# EAGLE schematic RGBLineSensor (EAGLE 9.6.2)
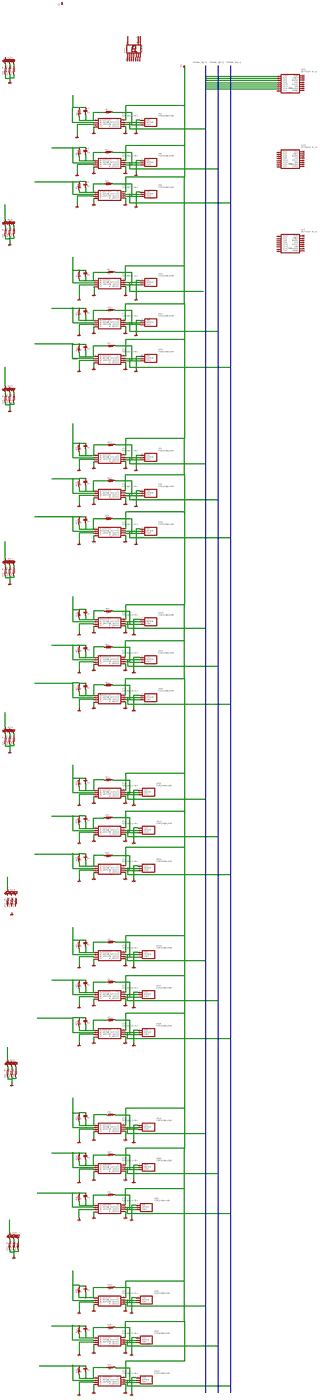
[diagram p0: schematic, sheet 1, overview]
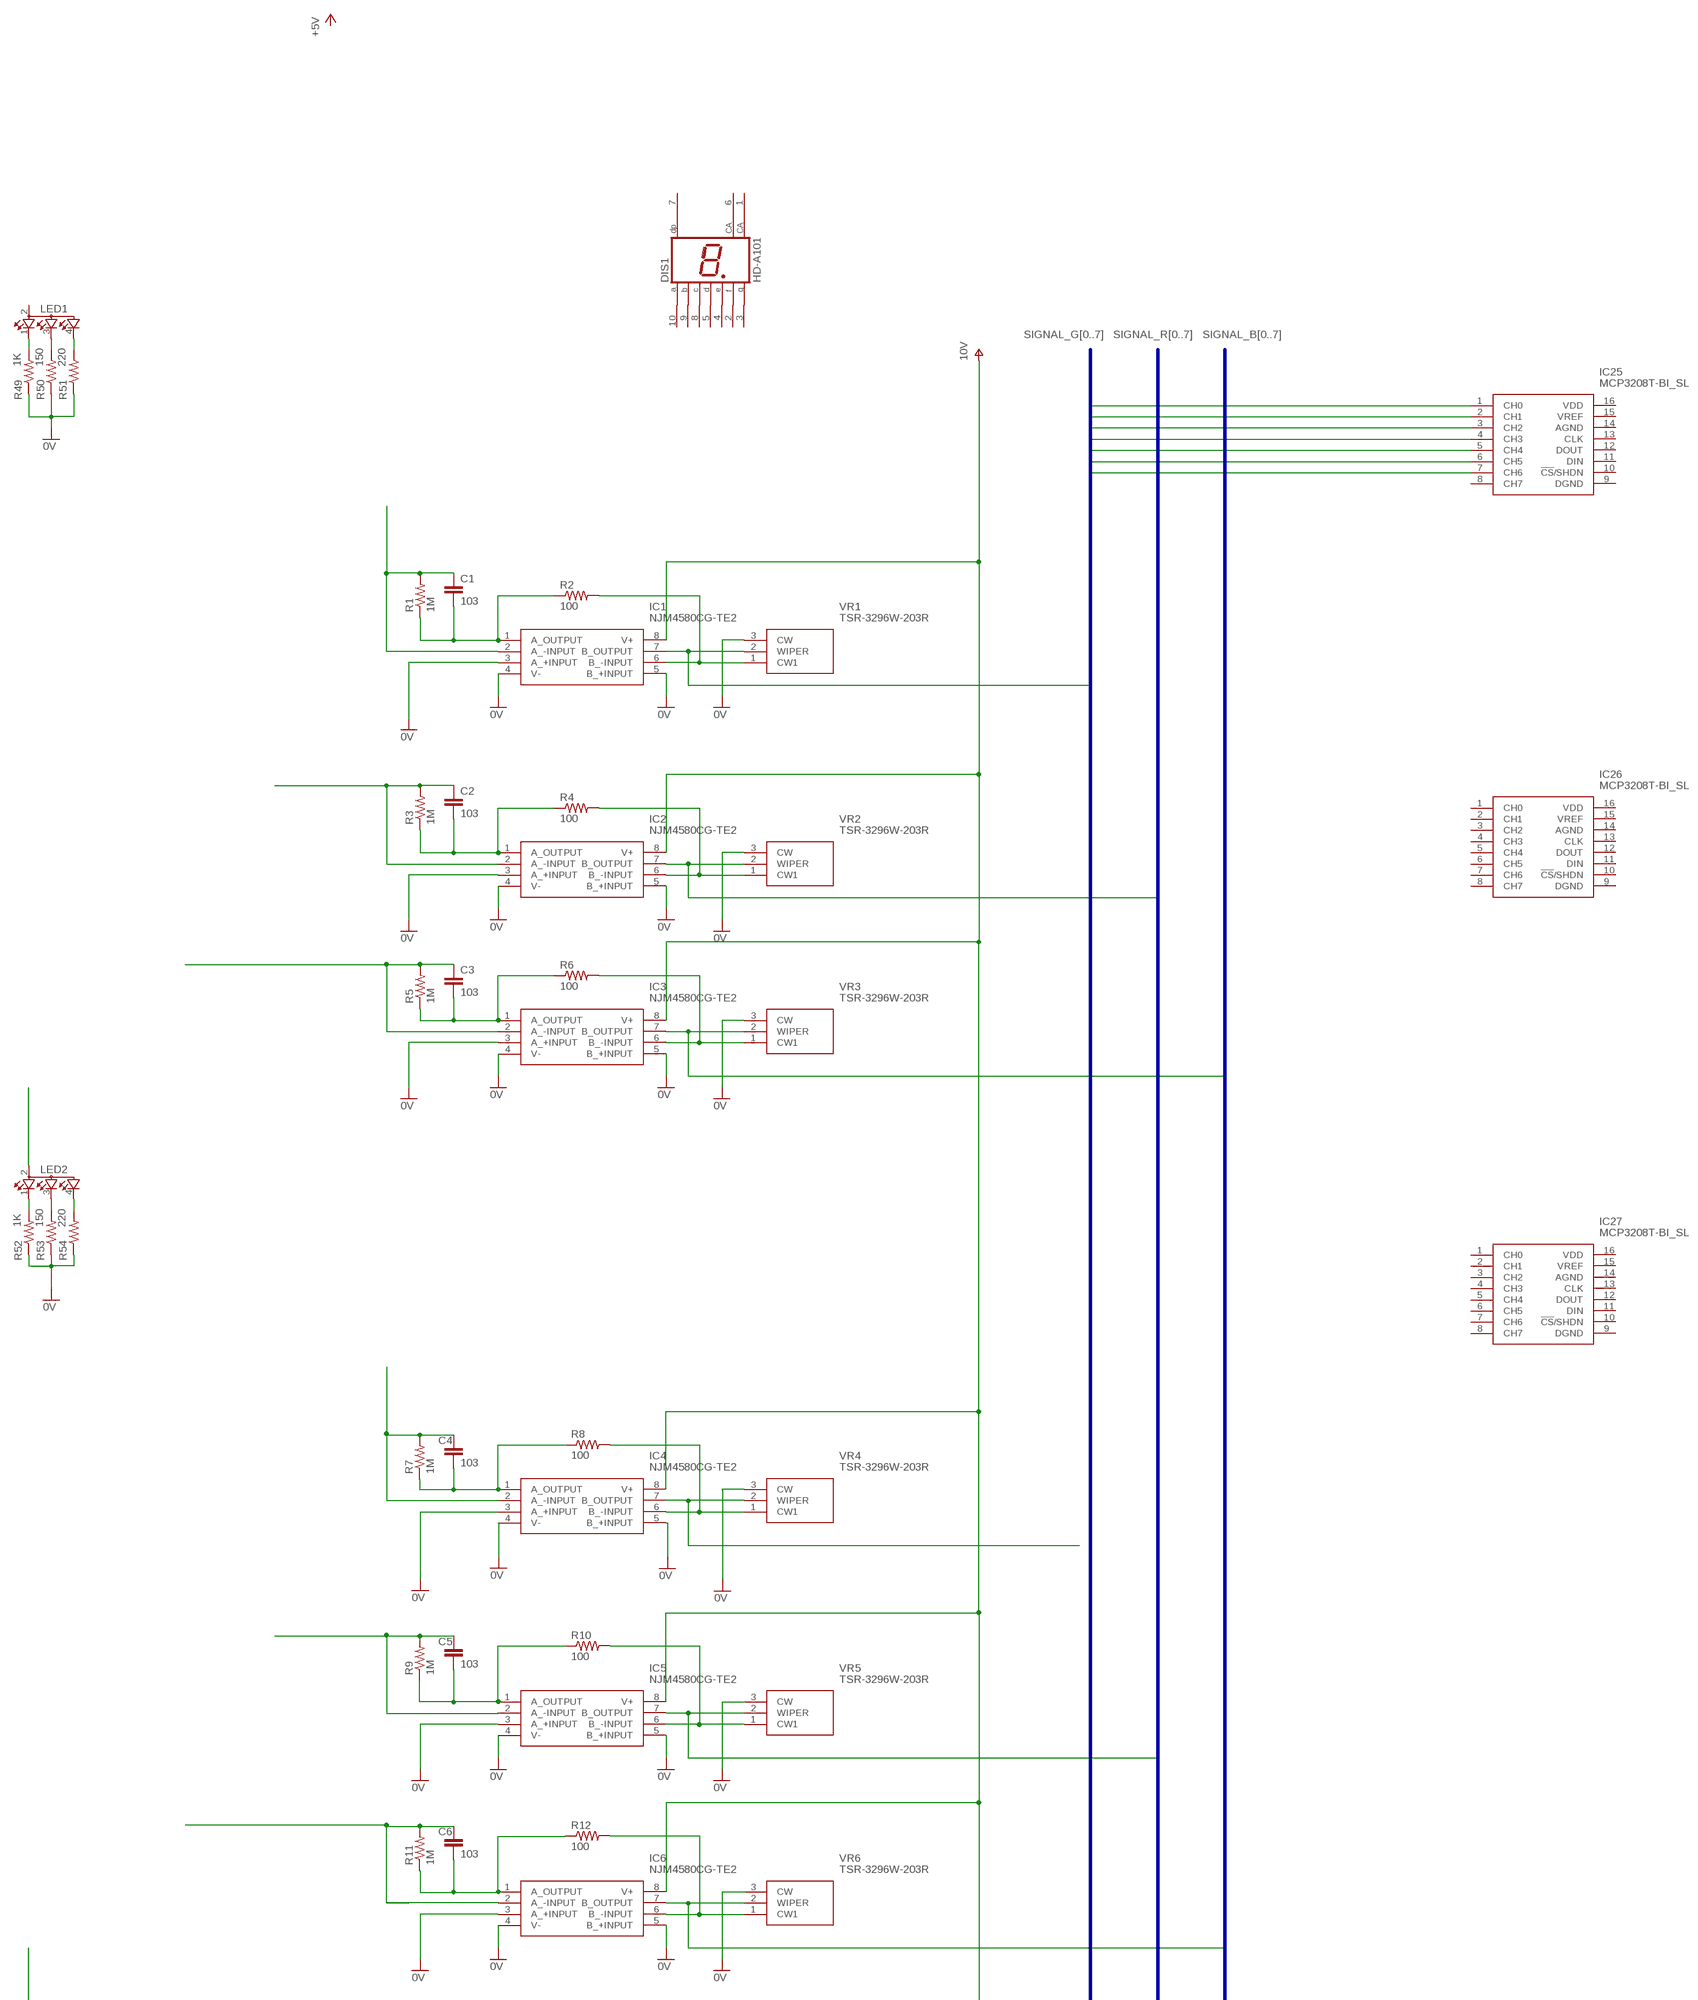
[diagram p1: schematic, sheet 1, part 1 of 4]
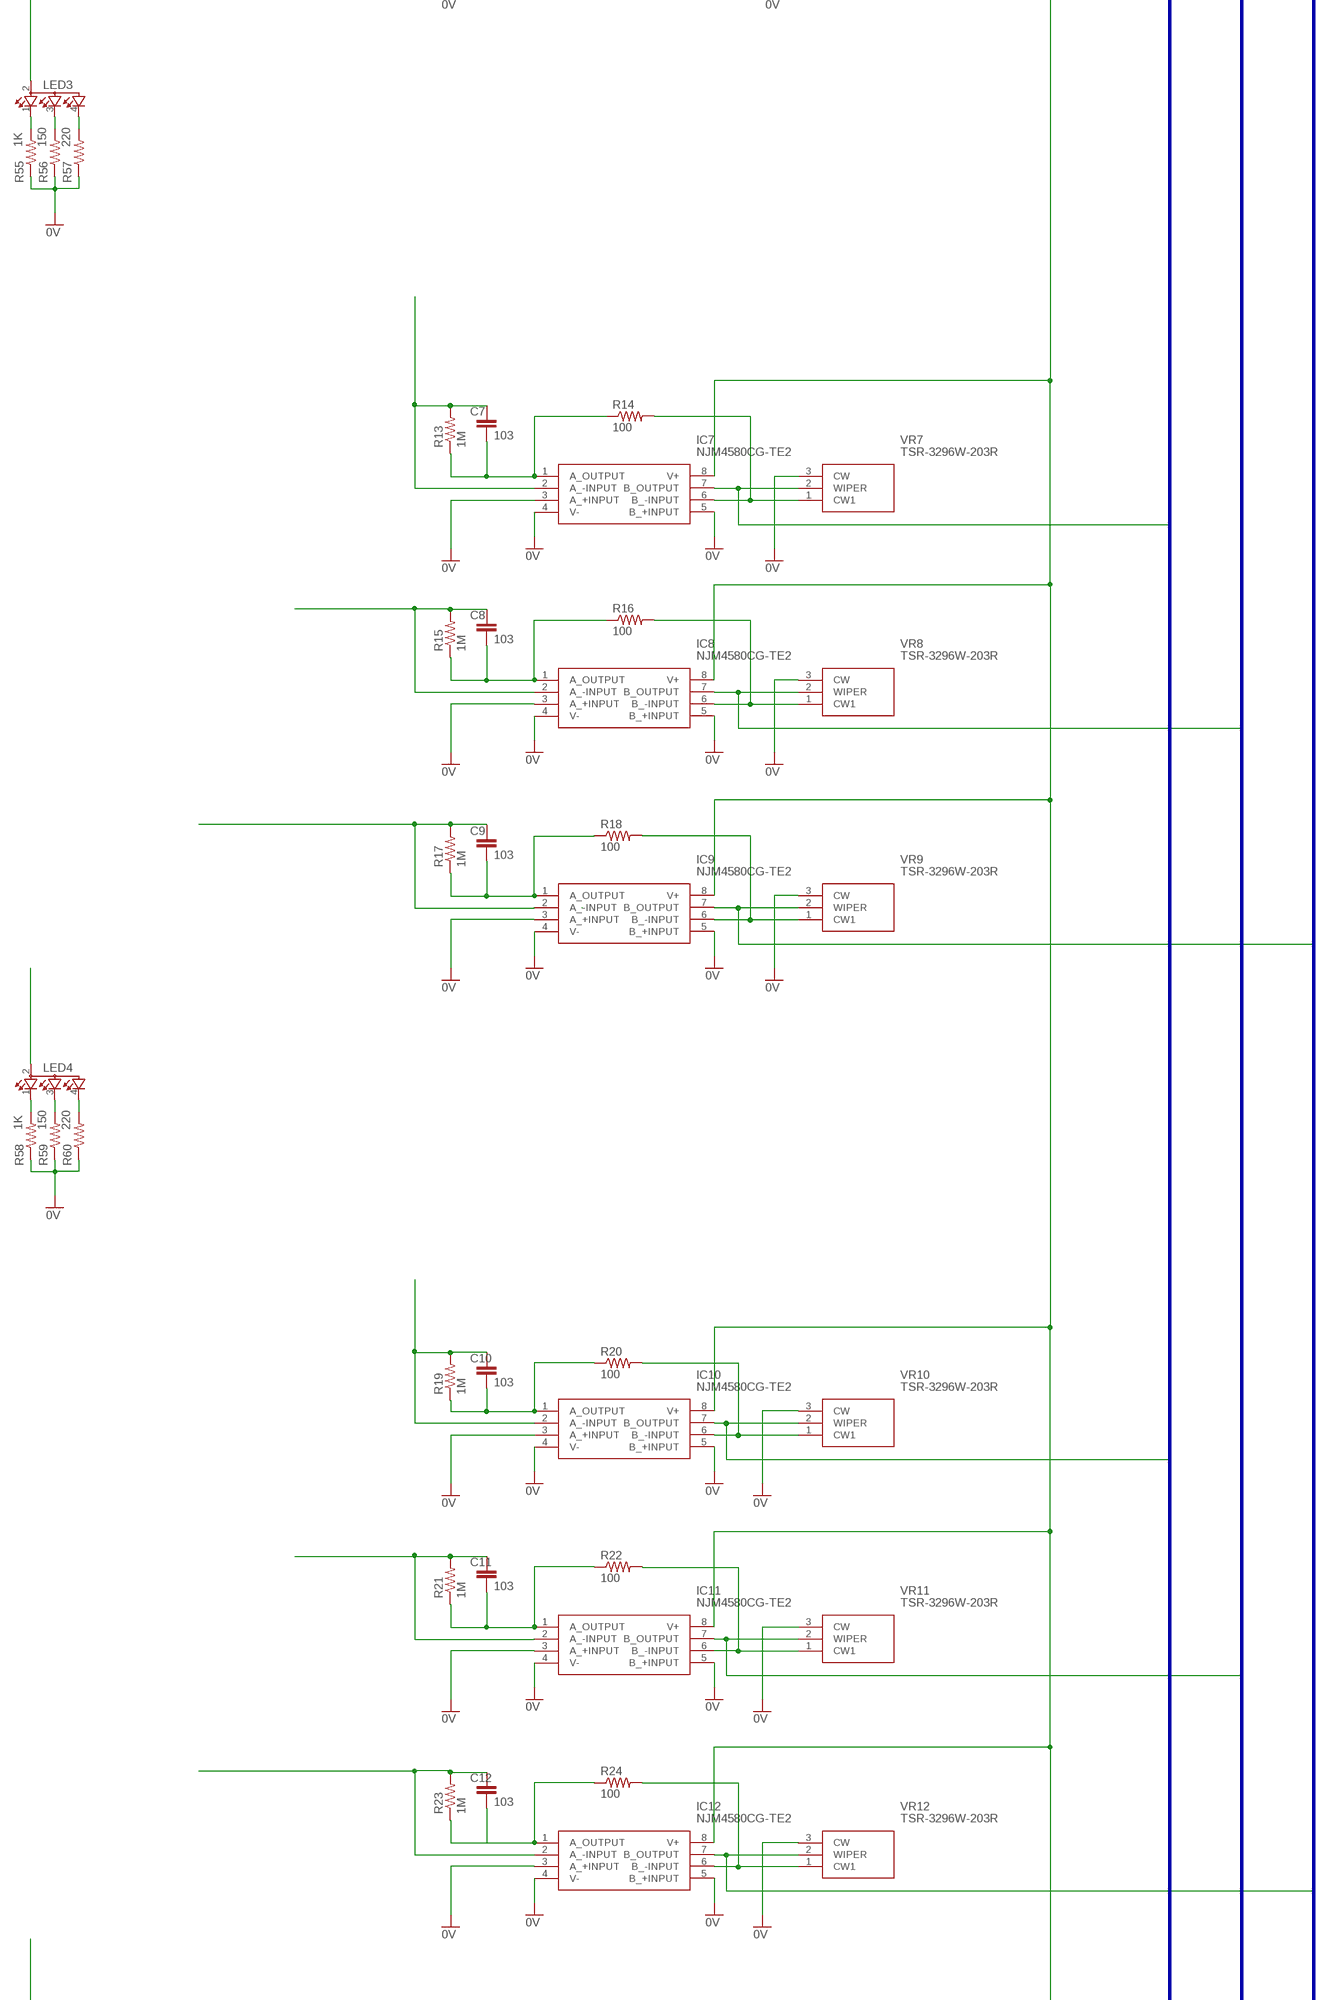
[diagram p2: schematic, sheet 1, part 2 of 4]
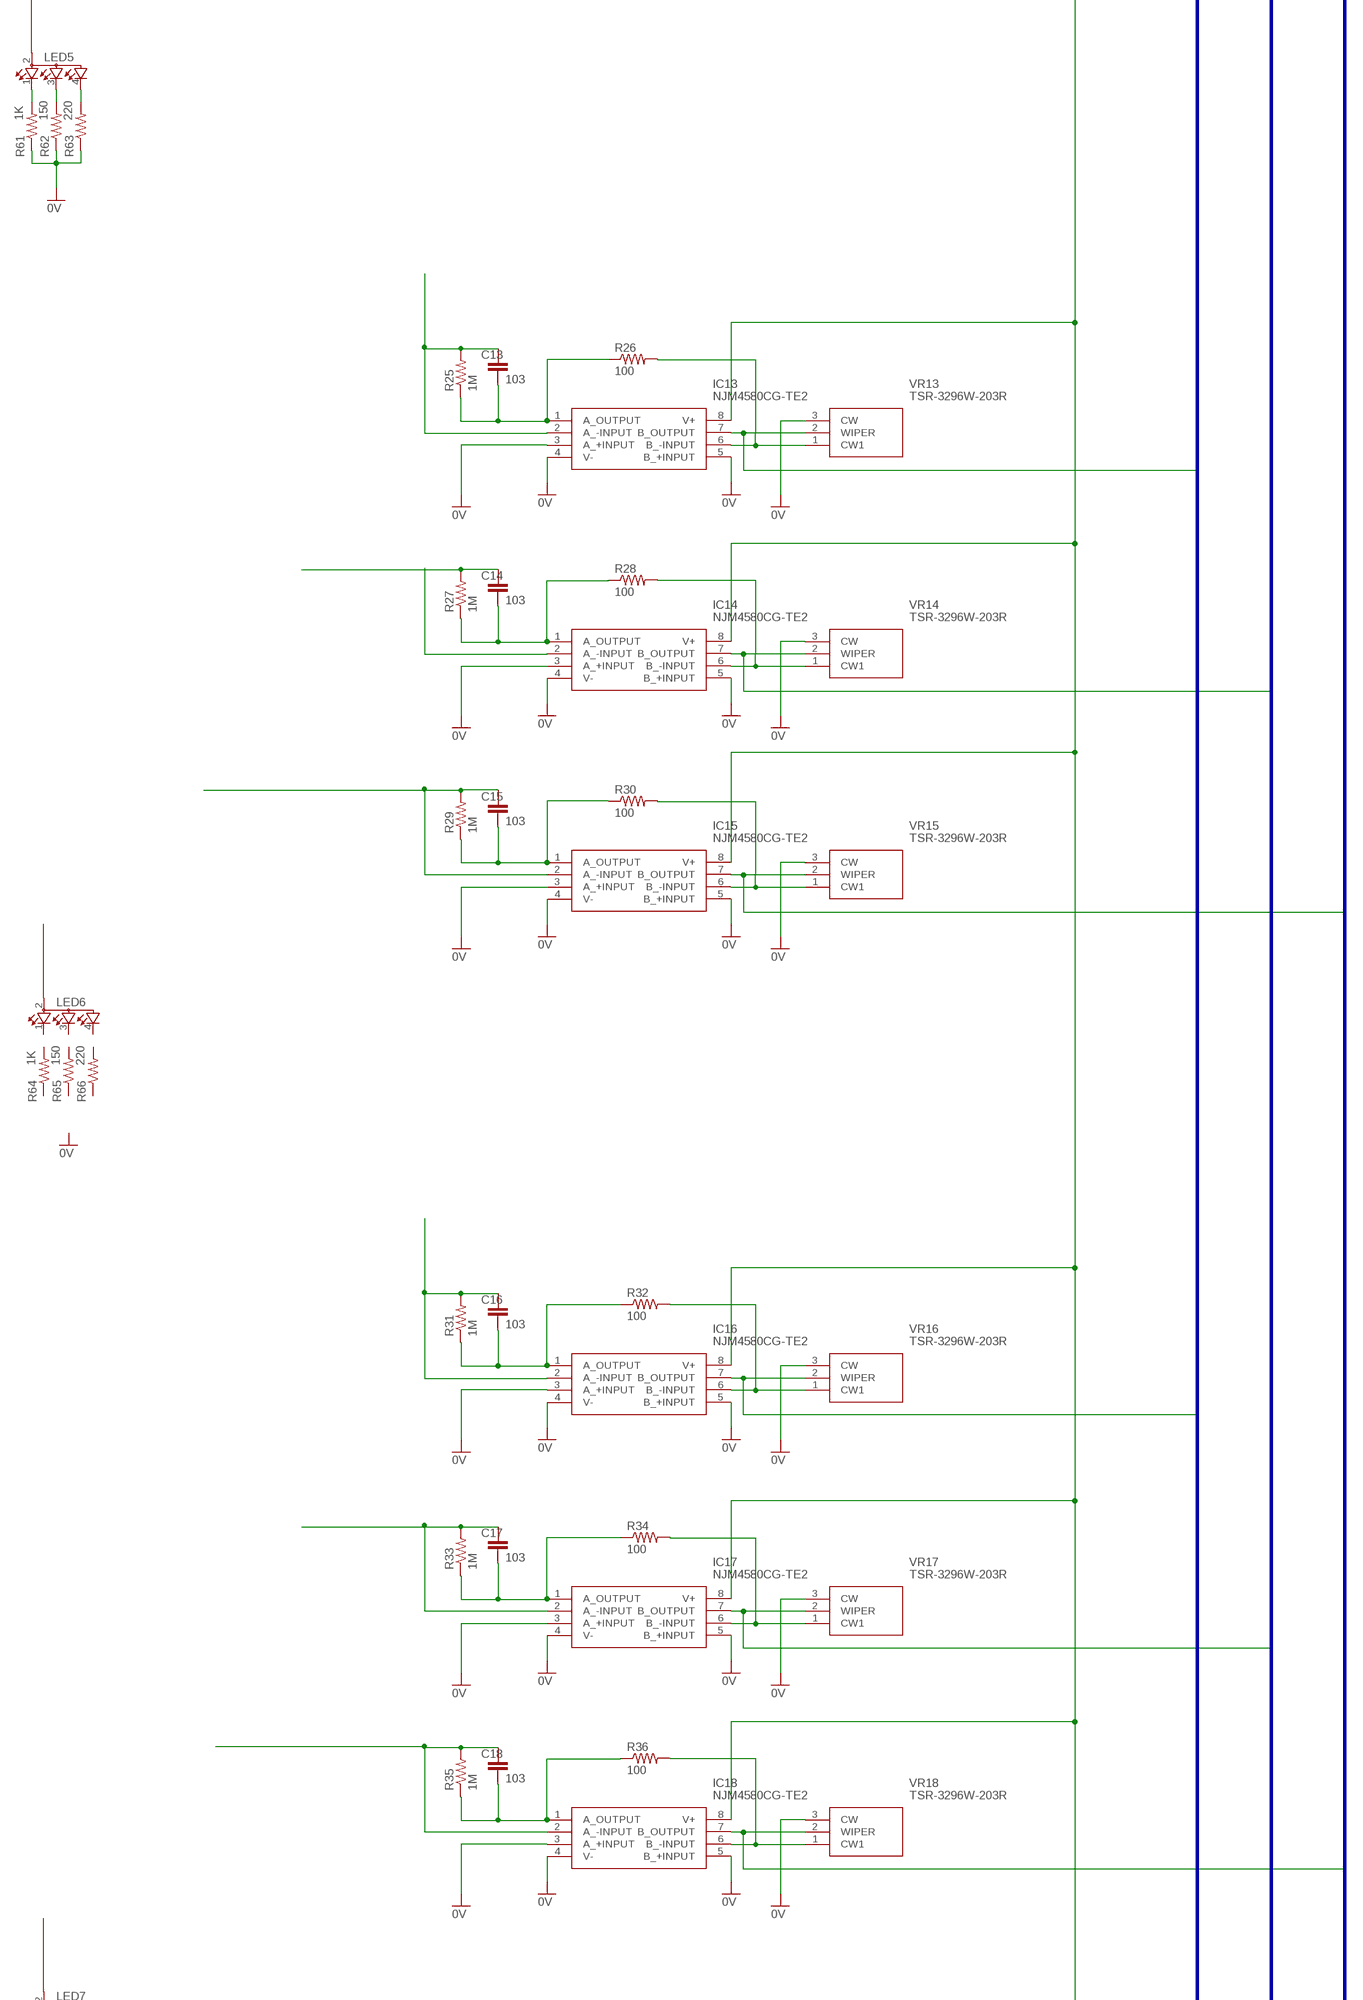
[diagram p3: schematic, sheet 1, part 3 of 4]
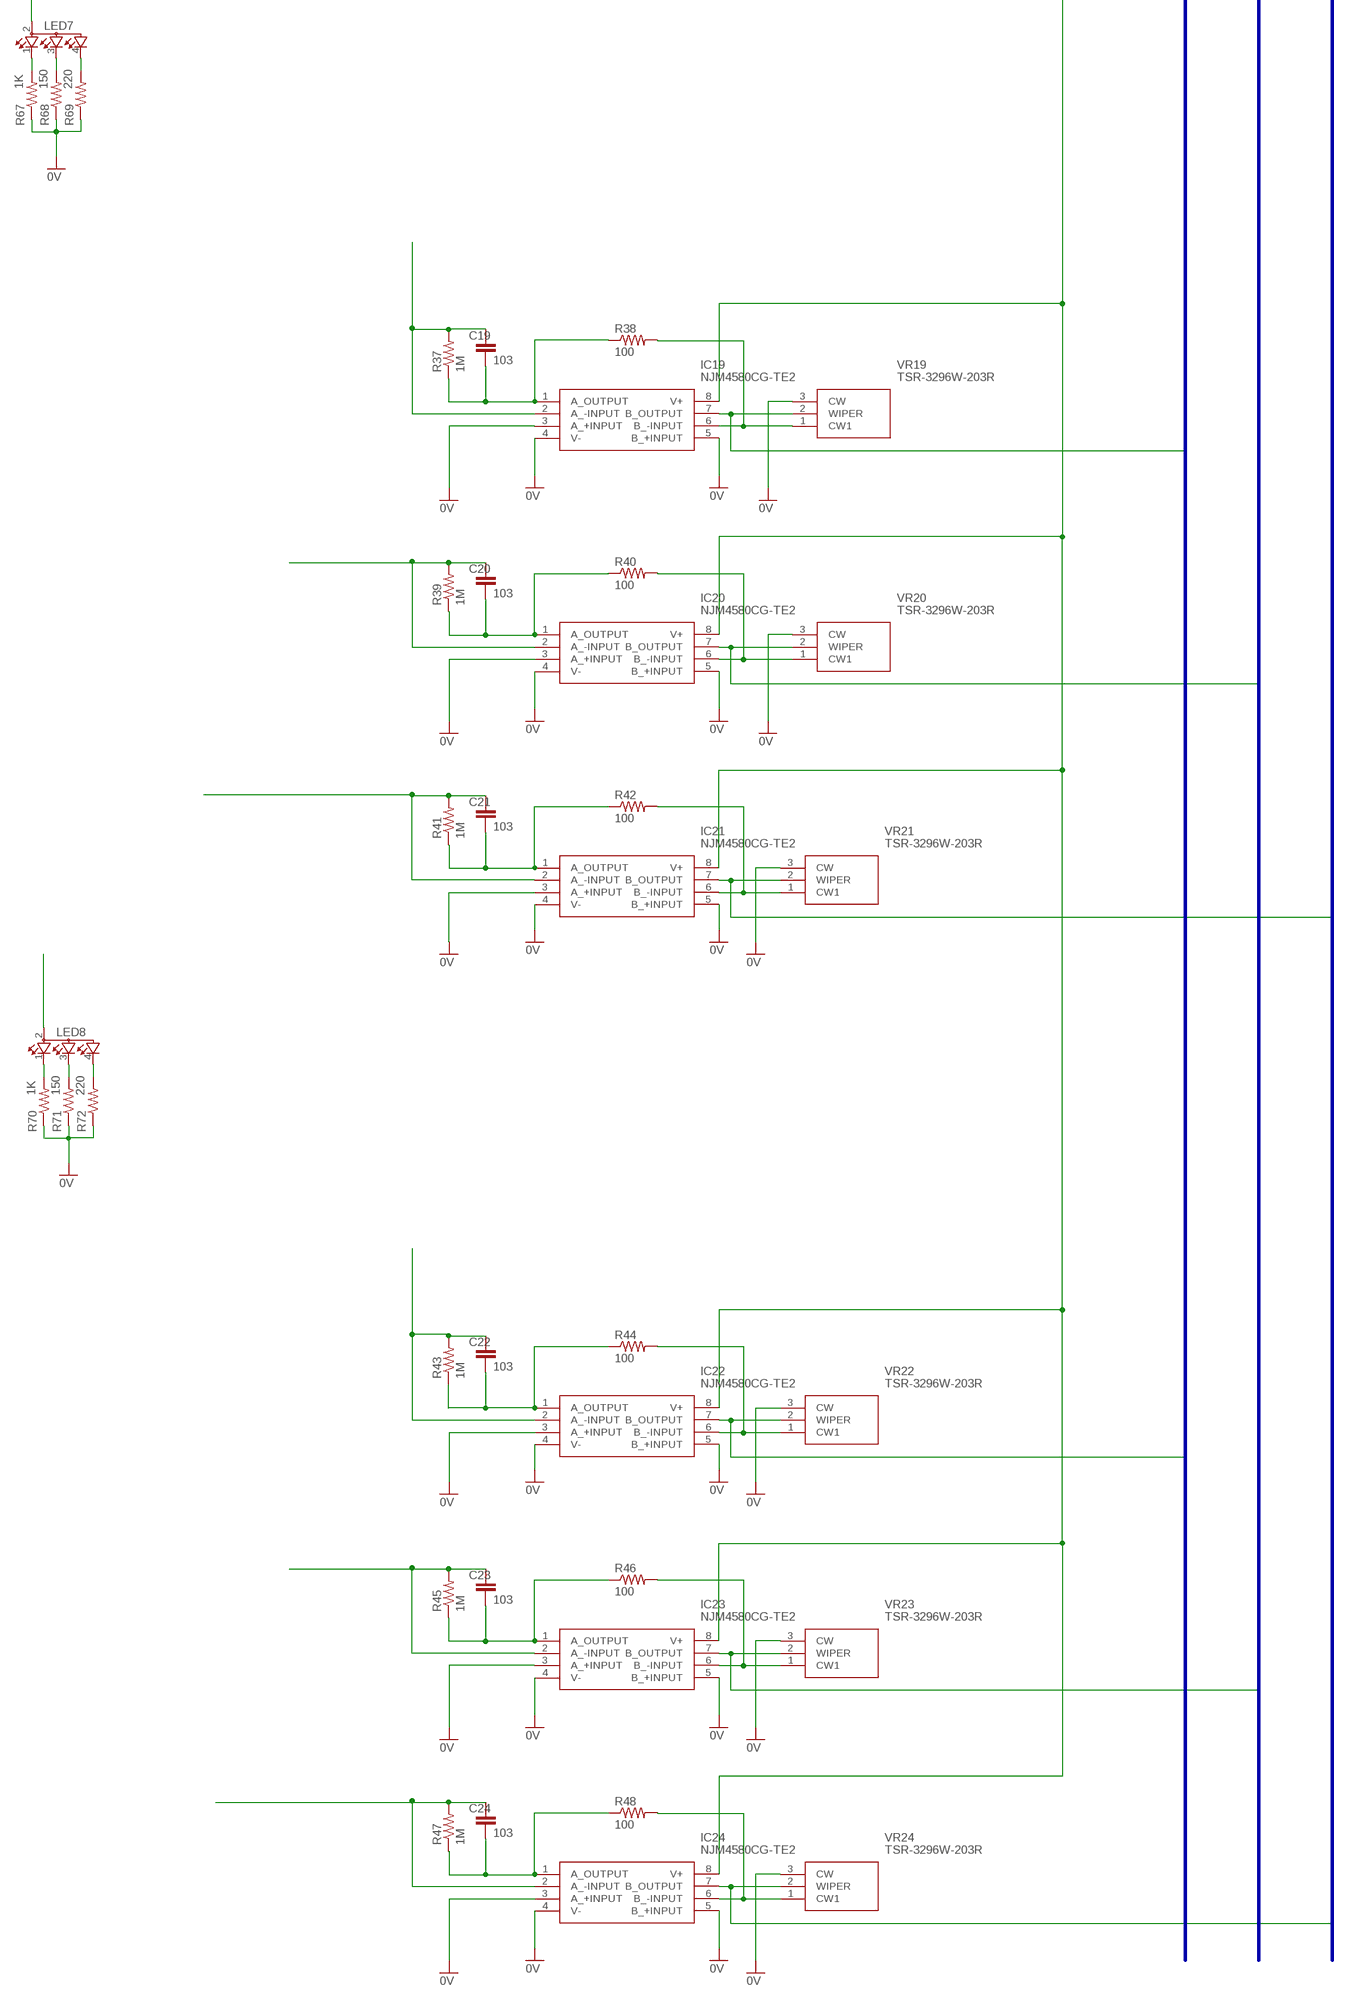
[diagram p4: schematic, sheet 1, part 4 of 4]

## Parts
C1  103  C-EUC2012  [C2012]
C2  103  C-EUC2012  [C2012]
C3  103  C-EUC2012  [C2012]
C4  103  C-EUC2012  [C2012]
C5  103  C-EUC2012  [C2012]
C6  103  C-EUC2012  [C2012]
C7  103  C-EUC2012  [C2012]
C8  103  C-EUC2012  [C2012]
C9  103  C-EUC2012  [C2012]
C10  103  C-EUC2012  [C2012]
C11  103  C-EUC2012  [C2012]
C12  103  C-EUC2012  [C2012]
C13  103  C-EUC2012  [C2012]
C14  103  C-EUC2012  [C2012]
C15  103  C-EUC2012  [C2012]
C16  103  C-EUC2012  [C2012]
C17  103  C-EUC2012  [C2012]
C18  103  C-EUC2012  [C2012]
C19  103  C-EUC2012  [C2012]
C20  103  C-EUC2012  [C2012]
C21  103  C-EUC2012  [C2012]
C22  103  C-EUC2012  [C2012]
C23  103  C-EUC2012  [C2012]
C24  103  C-EUC2012  [C2012]
DIS1  HD-A101  [HDSP-A]
IC1  NJM4580CG-TE2  [SOIC127P600X175-8N]
IC2  NJM4580CG-TE2  [SOIC127P600X175-8N]
IC3  NJM4580CG-TE2  [SOIC127P600X175-8N]
IC4  NJM4580CG-TE2  [SOIC127P600X175-8N]
IC5  NJM4580CG-TE2  [SOIC127P600X175-8N]
IC6  NJM4580CG-TE2  [SOIC127P600X175-8N]
IC7  NJM4580CG-TE2  [SOIC127P600X175-8N]
IC8  NJM4580CG-TE2  [SOIC127P600X175-8N]
IC9  NJM4580CG-TE2  [SOIC127P600X175-8N]
IC10  NJM4580CG-TE2  [SOIC127P600X175-8N]
IC11  NJM4580CG-TE2  [SOIC127P600X175-8N]
IC12  NJM4580CG-TE2  [SOIC127P600X175-8N]
IC13  NJM4580CG-TE2  [SOIC127P600X175-8N]
IC14  NJM4580CG-TE2  [SOIC127P600X175-8N]
IC15  NJM4580CG-TE2  [SOIC127P600X175-8N]
IC16  NJM4580CG-TE2  [SOIC127P600X175-8N]
IC17  NJM4580CG-TE2  [SOIC127P600X175-8N]
IC18  NJM4580CG-TE2  [SOIC127P600X175-8N]
IC19  NJM4580CG-TE2  [SOIC127P600X175-8N]
IC20  NJM4580CG-TE2  [SOIC127P600X175-8N]
IC21  NJM4580CG-TE2  [SOIC127P600X175-8N]
IC22  NJM4580CG-TE2  [SOIC127P600X175-8N]
IC23  NJM4580CG-TE2  [SOIC127P600X175-8N]
IC24  NJM4580CG-TE2  [SOIC127P600X175-8N]
IC25  MCP3208T-BI_SL  [SOIC127P600X175-16N]
IC26  MCP3208T-BI_SL  [SOIC127P600X175-16N]
IC27  MCP3208T-BI_SL  [SOIC127P600X175-16N]
LED1  TOPLED-3  [P-LCC-4-3]
LED2  TOPLED-3  [P-LCC-4-3]
LED3  TOPLED-3  [P-LCC-4-3]
LED4  TOPLED-3  [P-LCC-4-3]
LED5  TOPLED-3  [P-LCC-4-3]
LED6  TOPLED-3  [P-LCC-4-3]
LED7  TOPLED-3  [P-LCC-4-3]
LED8  TOPLED-3  [P-LCC-4-3]
R1  1M  R-US_R0402  [R0402]
R2  100  R-US_R0402  [R0402]
R3  1M  R-US_R0402  [R0402]
R4  100  R-US_R0402  [R0402]
R5  1M  R-US_R0402  [R0402]
R6  100  R-US_R0402  [R0402]
R7  1M  R-US_R0402  [R0402]
R8  100  R-US_R0402  [R0402]
R9  1M  R-US_R0402  [R0402]
R10  100  R-US_R0402  [R0402]
R11  1M  R-US_R0402  [R0402]
R12  100  R-US_R0402  [R0402]
R13  1M  R-US_R0402  [R0402]
R14  100  R-US_R0402  [R0402]
R15  1M  R-US_R0402  [R0402]
R16  100  R-US_R0402  [R0402]
R17  1M  R-US_R0402  [R0402]
R18  100  R-US_R0402  [R0402]
R19  1M  R-US_R0402  [R0402]
R20  100  R-US_R0402  [R0402]
R21  1M  R-US_R0402  [R0402]
R22  100  R-US_R0402  [R0402]
R23  1M  R-US_R0402  [R0402]
R24  100  R-US_R0402  [R0402]
R25  1M  R-US_R0402  [R0402]
R26  100  R-US_R0402  [R0402]
R27  1M  R-US_R0402  [R0402]
R28  100  R-US_R0402  [R0402]
R29  1M  R-US_R0402  [R0402]
R30  100  R-US_R0402  [R0402]
R31  1M  R-US_R0402  [R0402]
R32  100  R-US_R0402  [R0402]
R33  1M  R-US_R0402  [R0402]
R34  100  R-US_R0402  [R0402]
R35  1M  R-US_R0402  [R0402]
R36  100  R-US_R0402  [R0402]
R37  1M  R-US_R0402  [R0402]
R38  100  R-US_R0402  [R0402]
R39  1M  R-US_R0402  [R0402]
R40  100  R-US_R0402  [R0402]
R41  1M  R-US_R0402  [R0402]
R42  100  R-US_R0402  [R0402]
R43  1M  R-US_R0402  [R0402]
R44  100  R-US_R0402  [R0402]
R45  1M  R-US_R0402  [R0402]
R46  100  R-US_R0402  [R0402]
R47  1M  R-US_R0402  [R0402]
R48  100  R-US_R0402  [R0402]
R49  1K  R-US_R0402  [R0402]
R50  150  R-US_R0402  [R0402]
R51  220  R-US_R0402  [R0402]
R52  1K  R-US_R0402  [R0402]
R53  150  R-US_R0402  [R0402]
R54  220  R-US_R0402  [R0402]
R55  1K  R-US_R0402  [R0402]
R56  150  R-US_R0402  [R0402]
R57  220  R-US_R0402  [R0402]
R58  1K  R-US_R0402  [R0402]
R59  150  R-US_R0402  [R0402]
R60  220  R-US_R0402  [R0402]
R61  1K  R-US_R0402  [R0402]
R62  150  R-US_R0402  [R0402]
R63  220  R-US_R0402  [R0402]
R64  1K  R-US_R0402  [R0402]
R65  150  R-US_R0402  [R0402]
R66  220  R-US_R0402  [R0402]
R67  1K  R-US_R0402  [R0402]
R68  150  R-US_R0402  [R0402]
R69  220  R-US_R0402  [R0402]
R70  1K  R-US_R0402  [R0402]
R71  150  R-US_R0402  [R0402]
R72  220  R-US_R0402  [R0402]
VR1  TSR-3296W-203R  [TSR3296W203R]
VR2  TSR-3296W-203R  [TSR3296W203R]
VR3  TSR-3296W-203R  [TSR3296W203R]
VR4  TSR-3296W-203R  [TSR3296W203R]
VR5  TSR-3296W-203R  [TSR3296W203R]
VR6  TSR-3296W-203R  [TSR3296W203R]
VR7  TSR-3296W-203R  [TSR3296W203R]
VR8  TSR-3296W-203R  [TSR3296W203R]
VR9  TSR-3296W-203R  [TSR3296W203R]
VR10  TSR-3296W-203R  [TSR3296W203R]
VR11  TSR-3296W-203R  [TSR3296W203R]
VR12  TSR-3296W-203R  [TSR3296W203R]
VR13  TSR-3296W-203R  [TSR3296W203R]
VR14  TSR-3296W-203R  [TSR3296W203R]
VR15  TSR-3296W-203R  [TSR3296W203R]
VR16  TSR-3296W-203R  [TSR3296W203R]
VR17  TSR-3296W-203R  [TSR3296W203R]
VR18  TSR-3296W-203R  [TSR3296W203R]
VR19  TSR-3296W-203R  [TSR3296W203R]
VR20  TSR-3296W-203R  [TSR3296W203R]
VR21  TSR-3296W-203R  [TSR3296W203R]
VR22  TSR-3296W-203R  [TSR3296W203R]
VR23  TSR-3296W-203R  [TSR3296W203R]
VR24  TSR-3296W-203R  [TSR3296W203R]

## Nets
0V: IC1.4(V-) IC1.5(B_+INPUT) IC2.3(A_+INPUT) IC2.4(V-) IC2.5(B_+INPUT) IC3.3(A_+INPUT) IC3.4(V-) IC3.5(B_+INPUT) IC4.3(A_+INPUT) IC4.4(V-) IC4.5(B_+INPUT) IC5.3(A_+INPUT) IC5.4(V-) IC5.5(B_+INPUT) IC6.3(A_+INPUT) IC6.4(V-) IC6.5(B_+INPUT) IC7.3(A_+INPUT) IC7.4(V-) IC7.5(B_+INPUT) IC8.3(A_+INPUT) IC8.4(V-) IC8.5(B_+INPUT) IC9.3(A_+INPUT) IC9.4(V-) IC9.5(B_+INPUT) IC10.3(A_+INPUT) IC10.4(V-) IC10.5(B_+INPUT) IC11.3(A_+INPUT) IC11.4(V-) IC11.5(B_+INPUT) IC12.3(A_+INPUT) IC12.4(V-) IC12.5(B_+INPUT) IC13.3(A_+INPUT) IC13.4(V-) IC13.5(B_+INPUT) IC14.3(A_+INPUT) IC14.4(V-) IC14.5(B_+INPUT) IC15.3(A_+INPUT) IC15.4(V-) IC15.5(B_+INPUT) IC16.3(A_+INPUT) IC16.4(V-) IC16.5(B_+INPUT) IC17.3(A_+INPUT) IC17.4(V-) IC17.5(B_+INPUT) IC18.3(A_+INPUT) IC18.4(V-) IC18.5(B_+INPUT) IC19.3(A_+INPUT) IC19.4(V-) IC19.5(B_+INPUT) IC20.3(A_+INPUT) IC20.4(V-) IC20.5(B_+INPUT) IC21.3(A_+INPUT) IC21.4(V-) IC21.5(B_+INPUT) IC22.3(A_+INPUT) IC22.4(V-) IC22.5(B_+INPUT) IC23.3(A_+INPUT) IC23.4(V-) IC23.5(B_+INPUT) IC24.3(A_+INPUT) IC24.4(V-) IC24.5(B_+INPUT) R49.1 R50.1 R51.1 R52.1 R53.1 R54.1 R55.1 R56.1 R57.1 R58.1 R59.1 R60.1 R61.1 R62.1 R63.1 R67.1 R68.1 R69.1 R70.1 R71.1 R72.1 VR1.3(CW) VR2.3(CW) VR3.3(CW) VR5.3(CW) VR6.3(CW) VR7.3(CW) VR8.3(CW) VR9.3(CW) VR10.3(CW) VR11.3(CW) VR12.3(CW) VR13.3(CW) VR14.3(CW) VR15.3(CW) VR16.3(CW) VR17.3(CW) VR18.3(CW) VR19.3(CW) VR20.3(CW) VR21.3(CW) VR22.3(CW) VR23.3(CW) VR24.3(CW)
N$1: C1.1 IC1.2(A_-INPUT) R1.2
N$2: IC1.3(A_+INPUT) ; supply symbol labelled 0V
N$3: C1.2 IC1.1(A_OUTPUT) R1.1 R2.1
N$4: C7.1 IC7.2(A_-INPUT) R13.2
N$5: IC1.6(B_-INPUT) R2.2 VR1.1(CW1)
N$6: LED1.1(CRED) R49.2
N$7: C2.2 IC2.1(A_OUTPUT) R3.1 R4.1
N$8: C2.1 IC2.2(A_-INPUT) R3.2
N$9: IC2.6(B_-INPUT) R4.2 VR2.1(CW1)
N$10: LED1.3(CBLUE) R50.2
N$11: C3.2 IC3.1(A_OUTPUT) R5.1 R6.1
N$12: C7.2 IC7.1(A_OUTPUT) R13.1 R14.1
N$13: IC3.6(B_-INPUT) R6.2 VR3.1(CW1)
N$14: LED1.4(CGREEN) R51.2
N$15: C4.1 IC4.2(A_-INPUT) R7.2
N$16: C3.1 IC3.2(A_-INPUT) R5.2
N$17: IC4.1(A_OUTPUT) R7.1 R8.1
N$18: C4.2
N$19: IC4.6(B_-INPUT) VR4.1(CW1)
N$20: IC4.7(B_OUTPUT) VR4.2(WIPER)
N$21: VR4.3(CW)
N$22: R8.2
N$23: C5.1 R9.2
N$26: IC5.1(A_OUTPUT) R9.1 R10.1
N$27: C5.2
N$28: IC5.2(A_-INPUT)
N$29: IC5.6(B_-INPUT) R10.2 VR5.1(CW1)
N$30: IC5.7(B_OUTPUT) VR5.2(WIPER)
N$31: IC6.6(B_-INPUT) VR6.1(CW1)
N$32: LED3.1(CRED) R55.2
N$33: C6.2 IC6.1(A_OUTPUT) R11.1 R12.1
N$34: IC6.7(B_OUTPUT) VR6.2(WIPER)
N$35: R14.2
N$36: R12.2
N$37: LED3.3(CBLUE) R56.2
N$38: C6.1 IC6.2(A_-INPUT) R11.2
N$39: LED3.4(CGREEN) R57.2
N$40: IC7.7(B_OUTPUT) VR7.2(WIPER)
N$41: IC7.6(B_-INPUT) VR7.1(CW1)
N$42: C8.1 IC8.2(A_-INPUT) R15.2
N$43: C8.2 IC8.1(A_OUTPUT) R15.1 R16.1
N$44: C9.2 IC9.1(A_OUTPUT) R17.1 R18.1
N$45: IC8.6(B_-INPUT) VR8.1(CW1)
N$46: IC8.7(B_OUTPUT) VR8.2(WIPER)
N$47: IC9.2(A_-INPUT)
N$48: R16.2
N$50: IC9.6(B_-INPUT) VR9.1(CW1)
N$51: IC9.7(B_OUTPUT) VR9.2(WIPER)
N$52: C10.1 IC10.2(A_-INPUT) R19.2
N$53: R18.2
N$54: LED4.1(CRED) R58.2
N$55: C10.2 IC10.1(A_OUTPUT) R19.1 R20.1
N$56: LED4.3(CBLUE) R59.2
N$57: C11.1 R21.2
N$58: C11.2 IC11.1(A_OUTPUT) R21.1
N$59: IC10.7(B_OUTPUT) VR10.2(WIPER)
N$60: IC10.6(B_-INPUT) VR10.1(CW1)
N$61: R20.2
N$62: IC11.2(A_-INPUT)
N$63: IC11.6(B_-INPUT) R22.2 VR11.1(CW1)
N$64: IC11.7(B_OUTPUT) VR11.2(WIPER)
N$65: IC12.6(B_-INPUT) VR12.1(CW1)
N$66: IC12.7(B_OUTPUT) VR12.2(WIPER)
N$67: LED4.4(CGREEN) R60.2
N$68: C12.2 IC12.1(A_OUTPUT) R23.1 R24.1
N$69: R22.1
N$70: R24.2
N$71: LED3.2(A2)
N$72: C16.1 IC16.2(A_-INPUT) R31.2
N$73: C13.1 IC13.2(A_-INPUT) R25.2
N$74: C13.2 IC13.1(A_OUTPUT) R25.1 R26.1
N$75: C12.1 IC12.2(A_-INPUT) R23.2
N$76: C14.1 R27.2
N$77: IC13.6(B_-INPUT) VR13.1(CW1)
N$78: IC13.7(B_OUTPUT) VR13.2(WIPER)
N$79: IC14.2(A_-INPUT)
N$80: LED5.1(CRED) R61.2
N$81: C14.2 IC14.1(A_OUTPUT) R27.1 R28.1
N$82: IC14.6(B_-INPUT) VR14.1(CW1)
N$83: IC14.7(B_OUTPUT) VR14.2(WIPER)
N$84: LED5.3(CBLUE) R62.2
N$85: C15.1 R29.2
N$86: IC15.2(A_-INPUT)
N$87: C15.2 IC15.1(A_OUTPUT) R29.1 R30.1
N$88: C16.2 IC16.1(A_OUTPUT) R31.1 R32.1
N$89: IC16.6(B_-INPUT) VR16.1(CW1)
N$90: IC15.6(B_-INPUT) VR15.1(CW1)
N$91: IC15.7(B_OUTPUT) VR15.2(WIPER)
N$92: LED5.4(CGREEN) R63.2
N$93: IC16.7(B_OUTPUT) VR16.2(WIPER)
N$94: C17.1 R33.2
N$95: R32.2
N$96: C17.2 IC17.1(A_OUTPUT) R33.1 R34.1
N$97: IC17.2(A_-INPUT)
N$98: IC18.6(B_-INPUT) VR18.1(CW1)
N$99: IC17.6(B_-INPUT) VR17.1(CW1)
N$100: IC17.7(B_OUTPUT) VR17.2(WIPER)
N$101: R34.2
N$102: IC18.7(B_OUTPUT) VR18.2(WIPER)
N$103: C19.1 IC19.2(A_-INPUT) R37.2
N$104: C18.2 IC18.1(A_OUTPUT) R35.1 R36.1
N$105: C18.1 IC18.2(A_-INPUT) R35.2
N$106: R36.2
N$107: C19.2 IC19.1(A_OUTPUT) R37.1 R38.1
N$108: IC19.6(B_-INPUT) VR19.1(CW1)
N$109: IC19.7(B_OUTPUT) VR19.2(WIPER)
N$110: R38.2
N$111: C20.1 R39.2
N$112: C20.2 IC20.1(A_OUTPUT) R39.1 R40.1
N$113: IC20.7(B_OUTPUT) VR20.2(WIPER)
N$114: IC20.6(B_-INPUT) VR20.1(CW1)
N$115: R40.2
N$116: LED7.1(CRED) R67.2
N$117: IC20.2(A_-INPUT)
N$118: C21.2 IC21.1(A_OUTPUT) R41.1 R42.1
N$119: IC21.6(B_-INPUT) VR21.1(CW1)
N$120: IC21.7(B_OUTPUT) VR21.2(WIPER)
N$121: R42.2
N$122: IC22.1(A_OUTPUT) R44.1
N$123: C21.1 IC21.2(A_-INPUT) R41.2
N$124: C22.2
N$125: C23.1 R45.2
N$126: IC23.6(B_-INPUT) VR23.1(CW1)
N$127: IC22.6(B_-INPUT) VR22.1(CW1)
N$128: IC22.7(B_OUTPUT) VR22.2(WIPER)
N$129: R44.2
N$130: IC23.7(B_OUTPUT) VR23.2(WIPER)
N$131: IC23.2(A_-INPUT)
N$132: IC23.1(A_OUTPUT) R45.1 R46.1
N$133: C23.2
N$134: R46.2
N$135: IC24.6(B_-INPUT) VR24.1(CW1)
N$136: C24.1 R47.2
N$137: C24.2 IC24.1(A_OUTPUT) R47.1 R48.1
N$138: IC24.7(B_OUTPUT) VR24.2(WIPER)
N$139: C22.1 IC22.2(A_-INPUT) R43.2
N$140: R48.2
N$141: R43.1
N$142: IC24.2(A_-INPUT)
N$143: LED7.3(CBLUE) R68.2
N$144: LED7.4(CGREEN) R69.2
N$145: LED2.2(A2)
N$146: LED8.1(CRED) R70.2
N$147: LED8.3(CBLUE) R71.2
N$148: LED8.4(CGREEN) R72.2
N$149: LED4.2(A2)
N$150: LED2.1(CRED) R52.2
N$151: LED2.3(CBLUE) R53.2
N$152: LED2.4(CGREEN) R54.2
N$153: LED5.2(A2)
N$154: LED6.2(A2)
N$155: LED7.2(A2)
N$156: LED8.2(A2)
SIGNAL_B0: IC3.7(B_OUTPUT) VR3.2(WIPER)
SIGNAL_B4: R30.2
SIGNAL_G0: IC1.7(B_OUTPUT) IC25.1(CH0) VR1.2(WIPER)
SIGNAL_G1: IC25.2(CH1)
SIGNAL_G2: IC25.3(CH2)
SIGNAL_G3: IC25.4(CH3)
SIGNAL_G4: IC25.5(CH4) R26.2
SIGNAL_G5: IC25.6(CH5)
SIGNAL_G6: IC25.7(CH6)
SIGNAL_R0: IC2.7(B_OUTPUT) VR2.2(WIPER)
SIGNAL_R4: R28.2
V+: IC1.8(V+) IC2.8(V+) IC3.8(V+) IC4.8(V+) IC5.8(V+) IC6.8(V+) IC7.8(V+) IC8.8(V+) IC9.8(V+) IC10.8(V+) IC11.8(V+) IC12.8(V+) IC13.8(V+) IC14.8(V+) IC15.8(V+) IC16.8(V+) IC17.8(V+) IC18.8(V+) IC19.8(V+) IC20.8(V+) IC21.8(V+) IC22.8(V+) IC23.8(V+) IC24.8(V+) ; supply symbol labelled 10V
Unconnected: C9.1 DIS1.1(CA) DIS1.2(F) DIS1.3(G) DIS1.4(E) DIS1.5(D) DIS1.6(CA) DIS1.7(DP) DIS1.8(C) DIS1.9(B) DIS1.10(A) IC25.8(CH7) IC25.10(!CS!/SHDN) IC25.11(DIN) IC25.12(DOUT) IC25.13(CLK) IC25.15(VREF) IC26.1(CH0) IC26.2(CH1) IC26.3(CH2) IC26.4(CH3) IC26.5(CH4) IC26.6(CH5) IC26.7(CH6) IC26.8(CH7) IC26.10(!CS!/SHDN) IC26.11(DIN) IC26.12(DOUT) IC26.13(CLK) IC26.15(VREF) IC27.1(CH0) IC27.2(CH1) IC27.3(CH2) IC27.4(CH3) IC27.5(CH4) IC27.6(CH5) IC27.7(CH6) IC27.8(CH7) IC27.10(!CS!/SHDN) IC27.11(DIN) IC27.12(DOUT) IC27.13(CLK) IC27.15(VREF) LED1.2(A2) LED6.1(CRED) LED6.3(CBLUE) LED6.4(CGREEN) R17.2 R64.1 R64.2 R65.1 R65.2 R66.1 R66.2

## Buses
SIGNAL_G[0..7]
SIGNAL_R[0..7]
SIGNAL_B[0..7]

## Power pins joined to a net without a drawn wire
AGND: IC25.14(AGND) IC26.14(AGND) IC27.14(AGND)
DGND: IC25.9(DGND) IC26.9(DGND) IC27.9(DGND)
VDD: IC25.16(VDD) IC26.16(VDD) IC27.16(VDD)

## Library data of the parts
C1-C24 = rcl:C-EU: CAPACITOR, European symbol; SPICEPREFIX: C
DIS1 = display-hp:HD-A101: LED DISPLAY 1-character 7 segment, decimal point right; OC_FARNELL: unknown; OC_NEWARK: unknown
IC1-IC24 = NJM4580CG-TE2:NJM4580CG-TE2: Operational Amplifiers - Op Amps Dual Op Amp 2 to 18V 5nV 15MHz 5V Source: Datasheet <https://www.njr.com/semicon/PDF/NJM4580C_E.pdf>; DESCRIPTION: Operational Amplifiers - Op Amps Dual Op Amp 2 to 18V 5nV 15MHz 5V; HEIGHT: 1.75mm; MANUFACTURER_NAME: NJR; MANUFACTURER_PART_NUMBER: NJM4580CG-TE2
IC25-IC27 = MCP3208T-BI_SL:MCP3208T-BI_SL: Analog to Digital Converters - ADC 12-bit SPI 8 Chl Source: Datasheet <http://ww1.microchip.com/downloads/en/DeviceDoc/21298e.pdf>; ALLIED_NUMBER: 70454283; DESCRIPTION: Analog to Digital Converters - ADC 12-bit SPI 8 Chl; HEIGHT: 1.75mm; MANUFACTURER_NAME: Microchip; MANUFACTURER_PART_NUMBER: MCP3208T-BI/SL
LED1-LED8 = led:TOPLED-3: OSRAM - Hyper Multi TOPLED® (RGB) LB E673, LV E673, LT E673 - Power TOPLED® Enhanced optical Power LED (HOP2000) LS E67B, LA E67B, LO E67B, LY E67B - Hyper Multi TOPLED® Enhanced optical Power LED (HOP2000 / ATON®) LATB T66B - Hyper Multi TOPLED® Hyper-Bright LED LATB T686 Source: http://www.osram.convergy.de/
R1-R72 = rcl:R-US_: RESISTOR, American symbol; SPICEPREFIX: R
VR1-VR24 = TSR-3296W-203R:TSR-3296W-203R: Swquare Trimming Potentionmeter Source: Datasheet <http://akizukidenshi.com/download/ds/suntan/TSR-3296.pdf>; DESCRIPTION: Swquare Trimming Potentionmeter; HEIGHT: 10mm; MANUFACTURER_NAME: SUNTAN; MANUFACTURER_PART_NUMBER: TSR-3296W-203R